# Altium schematic sheet Drive.SchDoc
size 594 x 420 mm; SheetNumber: 1; SheetTotal: 1
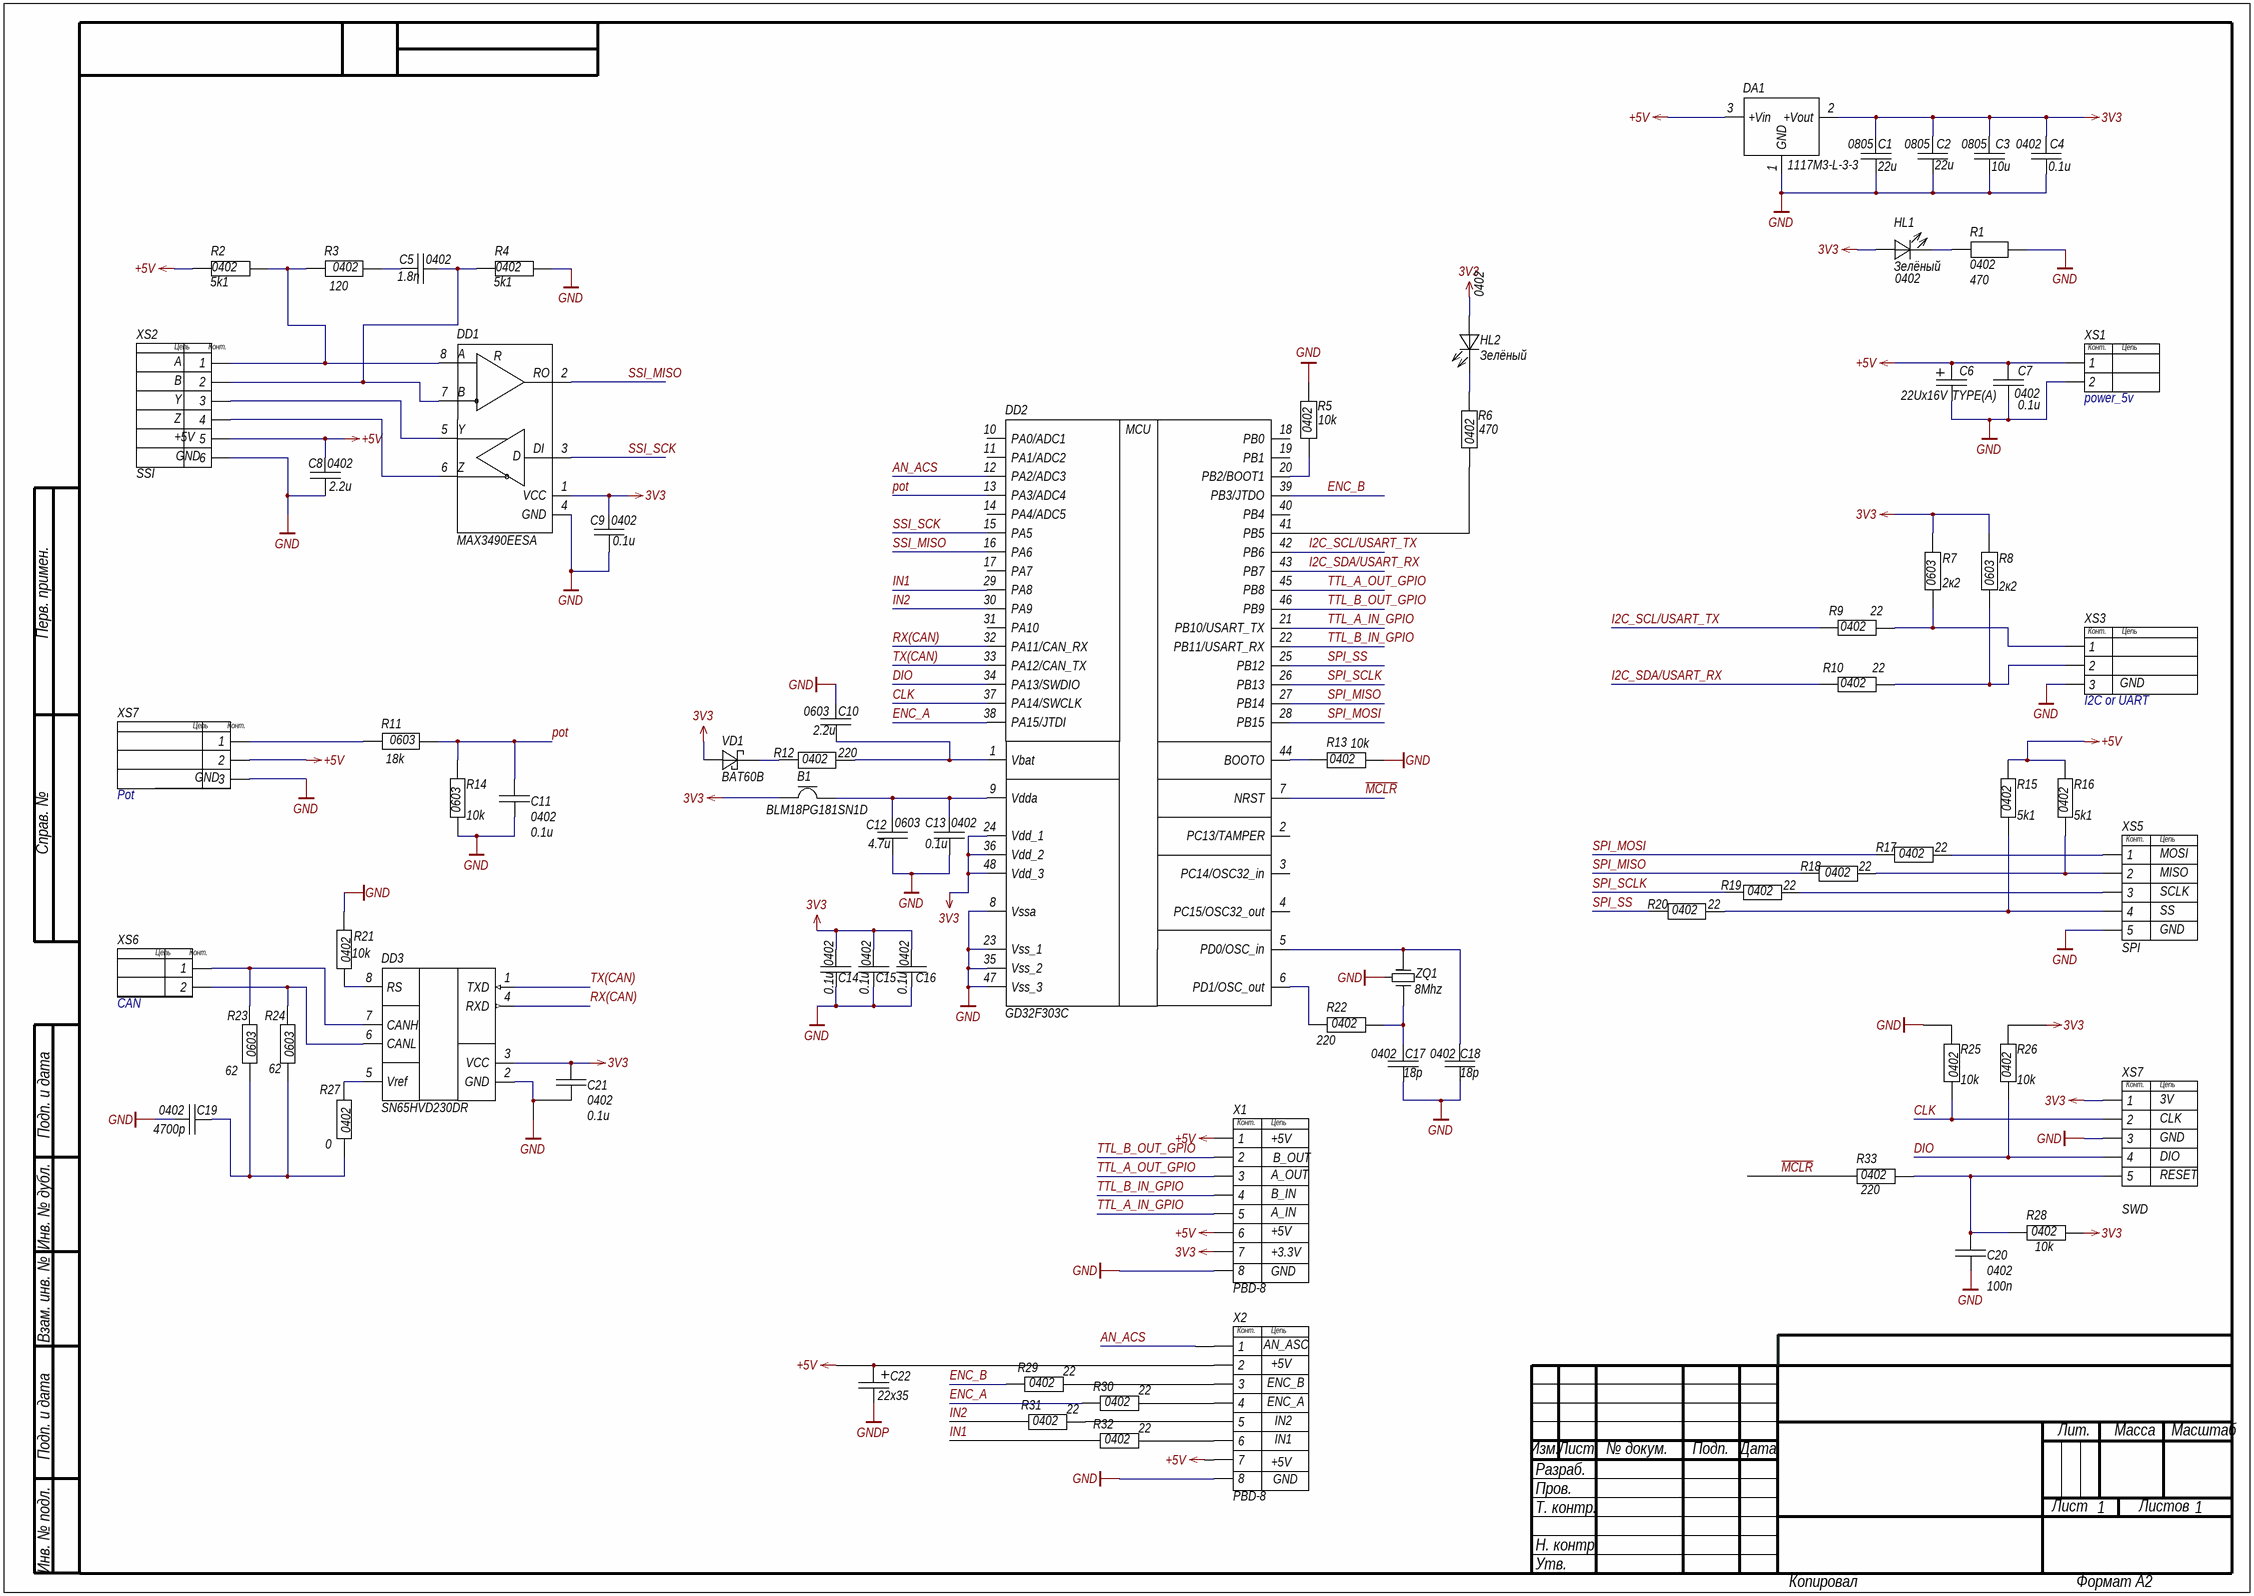
[diagram p0: Drive.SchDoc]

## Parts
(Parts that share a designator on the sheet are numbered #1, #2 ... from top to bottom, then left to right.)
B1  BLM18PG181SN1D  [Ferrite_Bead_0603]
C1  Case: 0805  [0805_cap]  (hidden comment: 22u)
C2  Case: 0805  [0805_cap]  (hidden comment: 22u)
C3  Case: 0805  [0805_cap]  (hidden comment: 10u)
C4  Case: 0402  [0402_CAP]  (hidden comment: 0.1u)
C5  Case: 0402  [0402_CAP]  (hidden comment: 1.8n)
C6  Case: TYPE(A)  [CASE A]  (hidden comment: 22Ux16V)
C7  Case: 0402  [0402_CAP]  (hidden comment: 0.1u)
C8  Case: 0402  [0402_CAP]  (hidden comment: 2.2u)
C9  Case: 0402  [0402_CAP]  (hidden comment: 0.1u)
C10  Case: 0603  [0603_CAP]  (hidden comment: 2.2u)
C11  Case: 0402  [0402_CAP]  (hidden comment: 0.1u)
C12  Case: 0603  [0603_CAP]  (hidden comment: 4.7u)
C13  Case: 0402  [0402_CAP]  (hidden comment: 0.1u)
C14  Case: 0402  [0402_CAP]  (hidden comment: 0.1u)
C15  Case: 0402  [0402_CAP]  (hidden comment: 0.1u)
C16  Case: 0402  [0402_CAP]  (hidden comment: 0.1u)
C17  Case: 0402  [0402_CAP]  (hidden comment: 18p)
C18  Case: 0402  [0402_CAP]  (hidden comment: 18p)
C19  Case: 0402  [0402_CAP]  (hidden comment: 4700p)
C20  Case: 0402  [0402_CAP]  (hidden comment: 100n)
C21  Case: 0402  [0402_CAP]  (hidden comment: 0.1u)
C22  22x35  [CASE D]
DA1  1117M3-L-3-3  [SOT-223 (3)]
DD1  MAX3490EESA  [SOIC-8]
DD2  GD32F303C  [LQFP-48]
DD3  SN65HVD230DR  [SOIC-8]
HL1  Зелёный  [0402_LED_GREEN]
HL2  Зелёный  [0402_LED_GREEN]
R1  Power: 0402  [0402_res]  (hidden comment: 470)
R2  Case: 0402  [0402_res]  (hidden comment: 5k1)
R3  Case: 0402  [0402_res]  (hidden comment: 120)
R4  Case: 0402  [0402_res]  (hidden comment: 5k1)
R5  Case: 0402  [0402_res]  (hidden comment: 10k)
R6  Power: 0402  [0402_res]  (hidden comment: 470)
R7  Case: 0603  [0603_RES]  (hidden comment: 2к2)
R8  Case: 0603  [0603_RES]  (hidden comment: 2к2)
R9  Case: 0402  [0402_res]  (hidden comment: 22)
R10  Case: 0402  [0402_res]  (hidden comment: 22)
R11  Case: 0603  [0603_RES]  (hidden comment: 18k)
R12  Power: 0402  [0402_res]  (hidden comment: 220)
R13  Case: 0402  [0402_res]  (hidden comment: 10k)
R14  Case: 0603  [0603_RES]  (hidden comment: 10k)
R15  Case: 0402  [0402_res]  (hidden comment: 5k1)
R16  Case: 0402  [0402_res]  (hidden comment: 5k1)
R17  Power: 0402  [0402_res]  (hidden comment: 22)
R18  Power: 0402  [0402_res]  (hidden comment: 22)
R19  Power: 0402  [0402_res]  (hidden comment: 22)
R20  Case: 0402  [0402_res]  (hidden comment: 22)
R21  Case: 0402  [0402_res]  (hidden comment: 10k)
R22  Case: 0402  [0402_res]  (hidden comment: 220)
R23  Case: 0603  [0603_RES]  (hidden comment: 62)
R24  Case: 0603  [0603_RES]  (hidden comment: 62)
R25  Case: 0402  [0402_res]  (hidden comment: 10k)
R26  Case: 0402  [0402_res]  (hidden comment: 10k)
R27  Case: 0402  [0402_res]  (hidden comment: 0)
R28  Case: 0402  [0402_res]  (hidden comment: 10k)
R29  Case: 0402  [0402_res]  (hidden comment: 22)
R30  Case: 0402  [0402_res]  (hidden comment: 22)
R31  Case: 0402  [0402_res]  (hidden comment: 22)
R32  Case: 0402  [0402_res]  (hidden comment: 22)
R33  Case: 0402  [0402_res]  (hidden comment: 220)
VD1  BAT60B  [SOD-323]
X1  PBD-8  Parameter 8: +5V  Parameter 7: B_OUT  Parameter 6: A_OUT  Parameter 5: B_IN  Parameter 4: A_IN  Parameter 2: +3.3V  Parameter 1: GND  [PBD_8_2mm]
X2  PBD-8  Parameter 8: AN_ASC  Parameter 7: +5V  Parameter 6: ENC_B  Parameter 5: ENC_A  Parameter 4: IN2  Parameter 3: IN1  Parameter 1: GND  [PBD_8_2mm]
XS1  power_5v  [STEP_2.54mm 2X1]
XS2  SSI  [PH6_2mm]
XS3  I2C or UART  [PH3_2mm]
XS5  SPI  [PH5_2mm]
XS6  CAN  [STEP_2.54mm 2X1]
XS7#1  Pot  [PH3_2mm]
XS7#2  SWD  [jumper_5pin_step2mm]
ZQ1  8Mhz  [KX-7T]

## Nets
3V3: B1.1 C1.1 C2.1 C3.1 C4.1 C9.2 C14.1 C15.1 C16.1 C21.1 DA1.2(+Vout) DD1.1(VCC) DD2.24(Vdd_1) DD2.36(Vdd_2) DD2.48(Vdd_3) DD3.3(VCC) HL1.A HL2.A R7.2 R8.2 R26.2 R28.2 VD1.A X1.7 XS7#2.1
+5V: C6.1 C7.1 C8.2 C22.1 DA1.3(+Vin) R2.1 R15.2 R16.2 X1.1 X1.6 X2.2 X2.7 XS1.1 XS2.5 XS7#1.2
GND: C1.2 C2.2 C3.2 C4.2 C6.2 C7.2 C8.1 C9.1 C10.2 C11.2 C12.1 C13.1 C14.2 C15.2 C16.2 C17.2 C18.2 C19.2 C20.2 C21.2 DA1.1(GND) DD1.4(GND) DD2.8(Vssa) DD2.23(Vss_1) DD2.35(Vss_2) DD2.47(Vss_3) DD3.2(GND) R1.1 R4.2 R5.2 R13.2 R14.1 R21.2 R25.2 X1.8 X2.8 XS1.2 XS2.6 XS3.3 XS5.5 XS7#1.3 XS7#2.3 ZQ1.3
GNDP: C22.2
AN_ACS: DD2.12(PA2/ADC3) X2.1
CLK: DD2.37(PA14/SWCLK) R25.1 XS7#2.2
DIO: DD2.34(PA13/SWDIO) R26.1 XS7#2.4
ENC_A: DD2.38(PA15/JTDI) R30.2
ENC_B: DD2.39(PB3/JTDO) R29.2
I2C_SCL/USART_TX: DD2.42(PB6) R9.2
I2C_SDA/USART_RX: DD2.43(PB7) R10.2
IN1: DD2.29(PA8) R32.2
IN2: DD2.30(PA9) R31.2
~{MCLR}: DD2.7(NRST) R33.1
pot: C11.1 DD2.13(PA3/ADC4) R11.1 R14.2
RX(CAN): DD2.32(PA11/CAN_RX) DD3.4(RXD)
SPI_MISO: DD2.27(PB14) R18.1
SPI_MOSI: DD2.28(PB15) R17.1
SPI_SCLK: DD2.26(PB13) R19.1
SPI_SS: DD2.25(PB12) R20.2
SSI_MISO: DD1.2 DD2.16(PA6)
SSI_SCK: DD1.3 DD2.15(PA5)
TTL_A_IN_GPIO: DD2.21(PB10/USART_TX) X1.5
TTL_A_OUT_GPIO: DD2.45(PB8) X1.3
TTL_B_IN_GPIO: DD2.22(PB11/USART_RX) X1.4
TTL_B_OUT_GPIO: DD2.46(PB9) X1.2
TX(CAN): DD2.33(PA12/CAN_TX) DD3.1(TXD)
NetB1_2: B1.2 C12.2 C13.2 DD2.9(Vdda)
NetC5_1: C5.1 R3.1
NetC5_2: C5.2 DD1.7 R4.1 XS2.2
NetC10_1: C10.1 DD2.1(Vbat) R12.1
NetC17_1: C17.1 R22.1 ZQ1.1
NetC18_1: C18.1 DD2.5(PD0/OSC_in) ZQ1.2
NetC19_1: C19.1 R23.1 R24.1 R27.1
NetC20_1: C20.1 R28.1 R33.2 XS7#2.5
NetDD1_5: DD1.5 XS2.3
NetDD1_6: DD1.6 XS2.4
NetDD1_8: DD1.8 R2.2 R3.2 XS2.1
NetDD2_6: DD2.6(PD1/OSC_out) R22.2
NetDD2_20: DD2.20(PB2/BOOT1) R5.1
NetDD2_41: DD2.41(PB5) R6.1
NetDD2_44: DD2.44(BOOTO) R13.1
NetDD3_5: DD3.5(Vref) R27.2
NetDD3_6: DD3.6(CANL) R24.2 XS6.2
NetDD3_7: DD3.7(CANH) R23.2 XS6.1
NetDD3_8: DD3.8(RS) R21.1
NetHL1_K: HL1.K R1.2
NetHL2_K: HL2.K R6.2
NetR7_1: R7.1 R9.1 XS3.1
NetR8_1: R8.1 R10.1 XS3.2
NetR11_2: R11.2 XS7#1.1
NetR12_2: R12.2 VD1.K
NetR15_1: R15.1 R20.1 XS5.4
NetR16_1: R16.1 R18.2 XS5.2
NetR17_2: R17.2 XS5.1
NetR19_2: R19.2 XS5.3
NetR29_1: R29.1 X2.3
NetR30_1: R30.1 X2.4
NetR31_1: R31.1 X2.5
NetR32_1: R32.1 X2.6

Not connected (* = marked no-connect by the designer): DD2 2(PC13/TAMPER) 3(PC14/OSC32_in) 4(PC15/OSC32_out) 10(PA0/ADC1) 11(PA1/ADC2) 14(PA4/ADC5) 17(PA7) 18(PB0) 19(PB1) 31(PA10) 40(PB4)

## Notes on the sheet
- (near HL2) 0402
- (near HL1) 0402
- Перв. примен.
- Справ. №
- Подп. и дата
- Инв. № дубл.
- Взам. инв. №
- Разраб.
- Изм.
- Лист
- № докум.
- Подп.
- Дата
- Лит.
- Масса
- Масштаб
- Пров.
- Т. контр.
- Листов
- Инв. № подл.
- Н. контр.
- Утв.
- Копировал
- Формат А2
- (in symbol Connecor_8pin) Конт.; Цепь
- (in symbol GD32F303C) MCU
- (in symbol I2C or UART) Конт.; Цепь; GND
- (in symbol MAX3490EESA) А; R; RO; B; Y; DI; D; Z
- (in symbol power_5v) Конт.; Цепь
- (in symbol SPI) Конт.; Цепь; MOSI; MISO; SCLK; SS; GND
- (in symbol SSI) Цепь; Конт.; A; B; Y; Z; +5V; GND
- (in symbol swd_JUMPER_5pin) Конт.; Цепь; 3V; CLK; GND; DIO; RESET

## Library data of the parts
B1 = Ferrite Bead
C1-C5 C7-C21 = Capacitor: ValueType: Конденсатор; ESR: *; Voltage: *; Dielectric: *; Package: =; Parameter 1: *
  C1 C2: Value: 22u
  C3: Value: 10u
  C4 C7 C9 C11 C13-C16 C21: Value: 0.1u
  C5: Value: 1.8n
  C8 C10: Value: 2.2u
  C12: Value: 4.7u
  C17 C18: Value: 18p
  C19: Value: 4700p
  C20: Value: 100n
C6 C22 = Capacitor_pol: ValueType: Конденсатор
  C6: Value: 22Ux16V
  C22: Value: 22x35
DD1 = MAX3490EESA: ValueManufacturer: Analog Devices; NomenclatureNumber: 8002979238; ComponentLink1Description: chipdip; ComponentLink1URL: https://www.chipdip.ru/product0/8002979238?ysclid=m3rd7su6kb974072814
DD2 = GD32F303C: ValueManufacturer: Giga Device; ValueDescription: Микроконтроллер; Case: LQFP-48; ValueManufacturerPartNumber: GD32F303C; ValueType: Микроконтроллер
HL1 HL2 = Led_green: ValueManufacturer: Foryard; ValueManufacturerPartNumber: fyls-0603ugc; Temp: -40°C...+85°C; ValueDescription: Светодиод; Case: 0603; Value: Зелёный; ValueType: Светодиод
R1-R33 = Resistor: ValueType: Резистор; Tolerance: *; URL: *; Temp: *; ValueManufacturer: *; ValueManufacturerPartNumber: *; ValueDescription: *
  R1 R6: Case: *; Value: 470
  R2 R4 R15 R16: Power: *; Value: 5k1
  R3: Power: *; Value: 120
  R5 R13 R14 R21 R25 R26 R28: Power: *; Value: 10k
  R7 R8: Power: *; Value: 2к2
  R9 R10 R20 R29-R32: Power: *; Value: 22
  R11: Power: *; Value: 18k
  R12: Case: *; Value: 220
  R17-R19: Case: *; Value: 22
  R22 R33: Power: *; Value: 220
  R23 R24: Power: *; Value: 62
  R27: Power: *; Value: 0
VD1 = DiodeSch_BAT60B: ValueManufacturer: NXP Semiconductors; ValueManufacturerPartNumber: BAT254
X1 X2 = Connecor_8pin: System: Connector
  X1: Parameter 3: +5V
  X2: Parameter 2: +5V
XS6 = power_5v
XS7#1 = I2C or UART
XS7#2 = swd_JUMPER_5pin
ZQ1 = Quartz: ValueType: Кварцевый резонатор; Value: 8Mhz